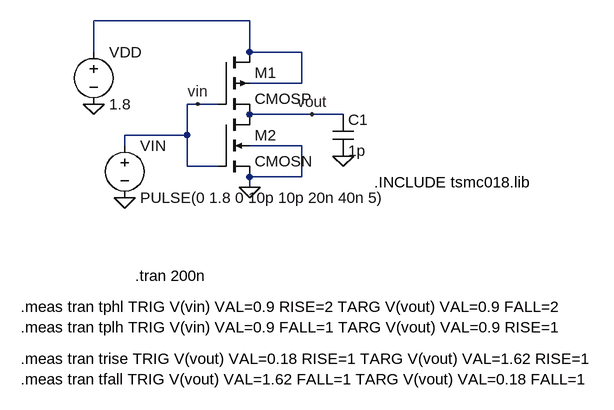
[diagram p0: schematic INVERTER-CMOS.asc]
INVERTER-CMOS.asc, the LTspice schematic file:
Version 4
SHEET 1 880 680
WIRE 240 0 0 0
WIRE 0 48 0 0
WIRE 240 48 240 0
WIRE 320 48 240 48
WIRE 320 96 320 48
WIRE 320 96 240 96
WIRE 160 128 144 128
WIRE 192 128 160 128
WIRE 336 144 240 144
WIRE 384 144 336 144
WIRE 144 176 144 128
WIRE 144 176 48 176
WIRE 48 192 48 176
WIRE 320 192 240 192
WIRE 144 224 144 176
WIRE 192 224 144 224
WIRE 320 240 320 192
WIRE 320 240 240 240
WIRE 240 256 240 240
FLAG 0 128 0
FLAG 48 272 0
FLAG 240 256 0
FLAG 384 208 0
FLAG 160 128 vin
FLAG 336 144 vout
SYMBOL cmosp 192 48 R0
SYMATTR InstName M1
SYMATTR Value2 l=180n w=1800n
SYMBOL cmosn 192 144 R0
SYMATTR InstName M2
SYMATTR Value2 l=180n w=900n
SYMBOL voltage 0 32 R0
SYMATTR InstName VDD
SYMATTR Value 1.8
SYMBOL voltage 48 176 R0
WINDOW 123 0 0 Left 0
WINDOW 39 0 0 Left 0
SYMATTR InstName VIN
SYMATTR Value PULSE(0 1.8 0 10p 10p 20n 40n 5)
SYMBOL cap 368 144 R0
SYMATTR InstName C1
SYMATTR Value 1p
TEXT 432 248 Left 2 !.INCLUDE tsmc018.lib
TEXT 64 392 Left 2 !.tran 200n
TEXT -112 440 Left 2 !.meas tran tphl TRIG V(vin) VAL=0.9 RISE=2 TARG V(vout) VAL=0.9 FALL=2\n.meas tran tplh TRIG V(vin) VAL=0.9 FALL=1 TARG V(vout) VAL=0.9 RISE=1
TEXT -112 520 Left 2 !.meas tran trise TRIG V(vout) VAL=0.18 RISE=1 TARG V(vout) VAL=1.62 RISE=1\n.meas tran tfall TRIG V(vout) VAL=1.62 FALL=1 TARG V(vout) VAL=0.18 FALL=1

The netlist it stands for:
* INVERTER-CMOS.asc
M1 N001 vin vout N001 CMOSP l=180n w=1800n
M2 vout vin 0 0 CMOSN l=180n w=900n
VDD N001 0 1.8
VIN vin 0 PULSE(0 1.8 0 10p 10p 20n 40n 5)
C1 vout 0 1p
.model NMOS NMOS
.model PMOS PMOS
.lib standard.mos
.INCLUDE tsmc018.lib
.tran 200n
.meas tran tphl TRIG V(vin) VAL=0.9 RISE=2 TARG V(vout) VAL=0.9 FALL=2
.meas tran tplh TRIG V(vin) VAL=0.9 FALL=1 TARG V(vout) VAL=0.9 RISE=1
.meas tran trise TRIG V(vout) VAL=0.18 RISE=1 TARG V(vout) VAL=1.62 RISE=1
.meas tran tfall TRIG V(vout) VAL=1.62 FALL=1 TARG V(vout) VAL=0.18 FALL=1
.backanno
.end